# EAGLE design modem_tda (EAGLE 6.5.0)
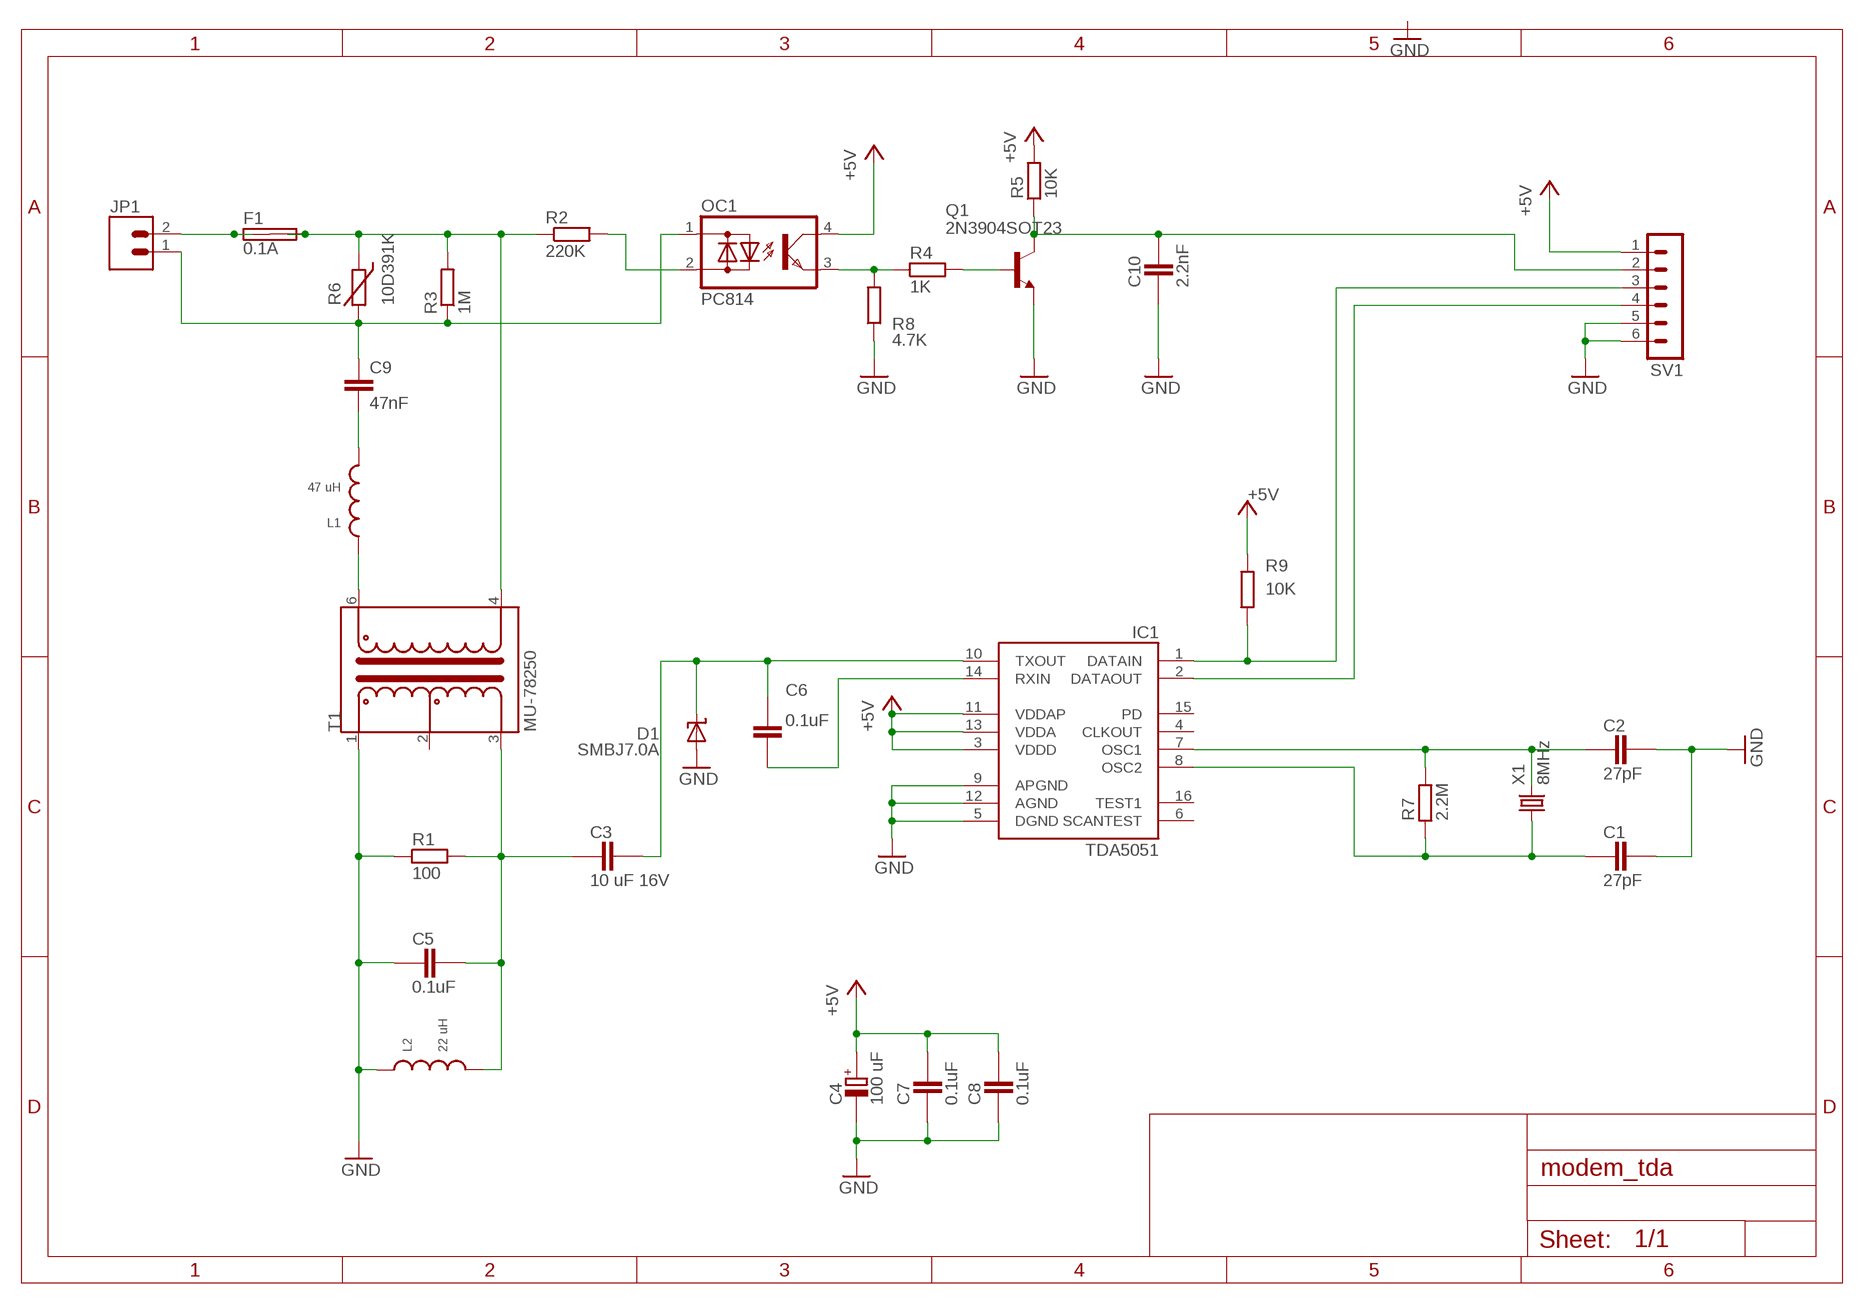
[diagram p0: schematic, sheet 1]

## Parts
C1  27pF  CAPACITOR_0805  [CAPC2012X145AN]
C2  27pF  CAPACITOR_0805  [CAPC2012X145AN]
C3  10 uF 16V  CAPACITOR_1206  [CAPC3215X168N]
C4  100 uF  POLARISED_U_CASE  [CAPMP6032X150N]
C5  0.1uF  CAPACITOR_0805  [CAPC2012X145AN]
C6  0.1uF  CAPACITOR_0805  [CAPC2012X145AN]
C7  0.1uF  CAPACITOR_0805  [CAPC2012X145AN]
C8  0.1uF  CAPACITOR_0805  [CAPC2012X145AN]
C9  47nF  CXXC10B6  [XC10B6]
C10  2.2nF  CAPACITOR_0805  [CAPC2012X145AN]
D1  SMBJ7.0A  SUPPRESSOR-SMBJ  [SMBJ]
F1  0.1A  SHK20L  [SHK20L]
IC1  TDA5051  [SO16W]
JP1  BLUE_TERM  [BLUE_TERM]
L1  47 uH  L-US  [CD43]
L2  22 uH  L-US  [CD43]
OC1  PC814  [DIL04]
Q1  2N3904SOT23  [SOT23-BEC]
R1  100  RESISTOR_0805  [RESC2012X70N]
R2  220K  R-EU_0309/12  [0309/12]
R3  1M  R-EU_0207/10  [0207/10]
R4  1K  RESISTOR_0805  [RESC2012X70N]
R5  10K  RESISTOR_0805  [RESC2012X70N]
R6  10D391K  VARISTOR  [MOV-10D]
R7  2.2M  RESISTOR_0805  [RESC2012X70N]
R8  4.7K  RESISTOR_0805  [RESC2012X70N]
R9  10K  RESISTOR_0805  [RESC2012X70N]
SV1  MA06-1  [MA06-1]
T1  MU-78250  [6-PIN-DIL]
X1  8MHz  CRYSTALHC49S  [HC49/S]

## Nets
+5V: C4.+ C7.2 C8.2 IC1.3(VDDD) IC1.11(VDDAP) IC1.13(VDDA) OC1.4(C) R5.2 R9.2 SV1.1
GND: C1.2 C2.2 C4.- C5.1 C7.1 C8.1 C10.1 D1.A IC1.5(DGND) IC1.9(APGND) IC1.12(AGND) L2.1 Q1.E R1.1 R8.1 SV1.5 SV1.6 T1.1
N$1: F1.1A F1.1B JP1.2
N$2: F1.2A F1.2B R2.1 R3.2 R6.2 T1.4
N$3: C9.1 JP1.1 OC1.1(AC1) R3.1 R6.1
N$4: OC1.2(AC2) R2.2
N$5: C9.2 L1.2
N$6: L1.1 T1.6
N$7: OC1.3(E) R4.1 R8.2
N$8: C3.1 C5.2 L2.2 R1.2 T1.3
N$9: C3.2 C6.2 D1.C IC1.10(TXOUT)
N$10: C10.2 Q1.C R5.1 SV1.2
N$11: C6.1 IC1.14(RXIN)
N$12: C2.1 IC1.7(OSC1) R7.2 X1.2
N$13: C1.1 IC1.8(OSC2) R7.1 X1.1
N$14: IC1.1(DATAIN) R9.1 SV1.3
N$15: IC1.2(DATAOUT) SV1.4
N$16: Q1.B R4.2
Unconnected: IC1.4(CLKOUT) IC1.6(SCANTEST) IC1.15(PD) IC1.16(TEST1) T1.2

## Library data of the parts
C1-C3 C5-C8 C10 = ipc-7351-capacitor:CAPACITOR_
C4 = ipc-7351-capacitor:POLARISED_
C9 = rcl:CX: X CAPACITOR for power line
D1 = diode:SUPPRESSOR-: Suppressor diode
F1 = fuse:SHK20L: FUSE HOLDER 5 x 20 mm, SH contact, SHH1 Schukat, E1073 Buerklin
IC1 = nxp:TDA5051
JP1 = jlab:BLUE_TERM
L1 L2 = jlab_varistors:L-US
OC1 = optocoupler:PC814: SHARP OPTO COUPLER; OC_FARNELL: 9707662; OC_NEWARK: unknown
Q1 = transistor-npn:2N3904: NPN Transistor
R1 R4 R5 R7-R9 = ipc-7351-resistor:RESISTOR_
R2 R3 = rcl:R-EU_: RESISTOR, European symbol
R6 = jlab_varistors:VARISTOR
SV1 = con-lstb:MA06-1: PIN HEADER; OC_FARNELL: unknown; OC_NEWARK: unknown
T1 = jlab:MU-78250
X1 = crystal:CRYSTAL: CRYSTAL; OC_FARNELL: 1667008; OC_NEWARK: unknown

## Board
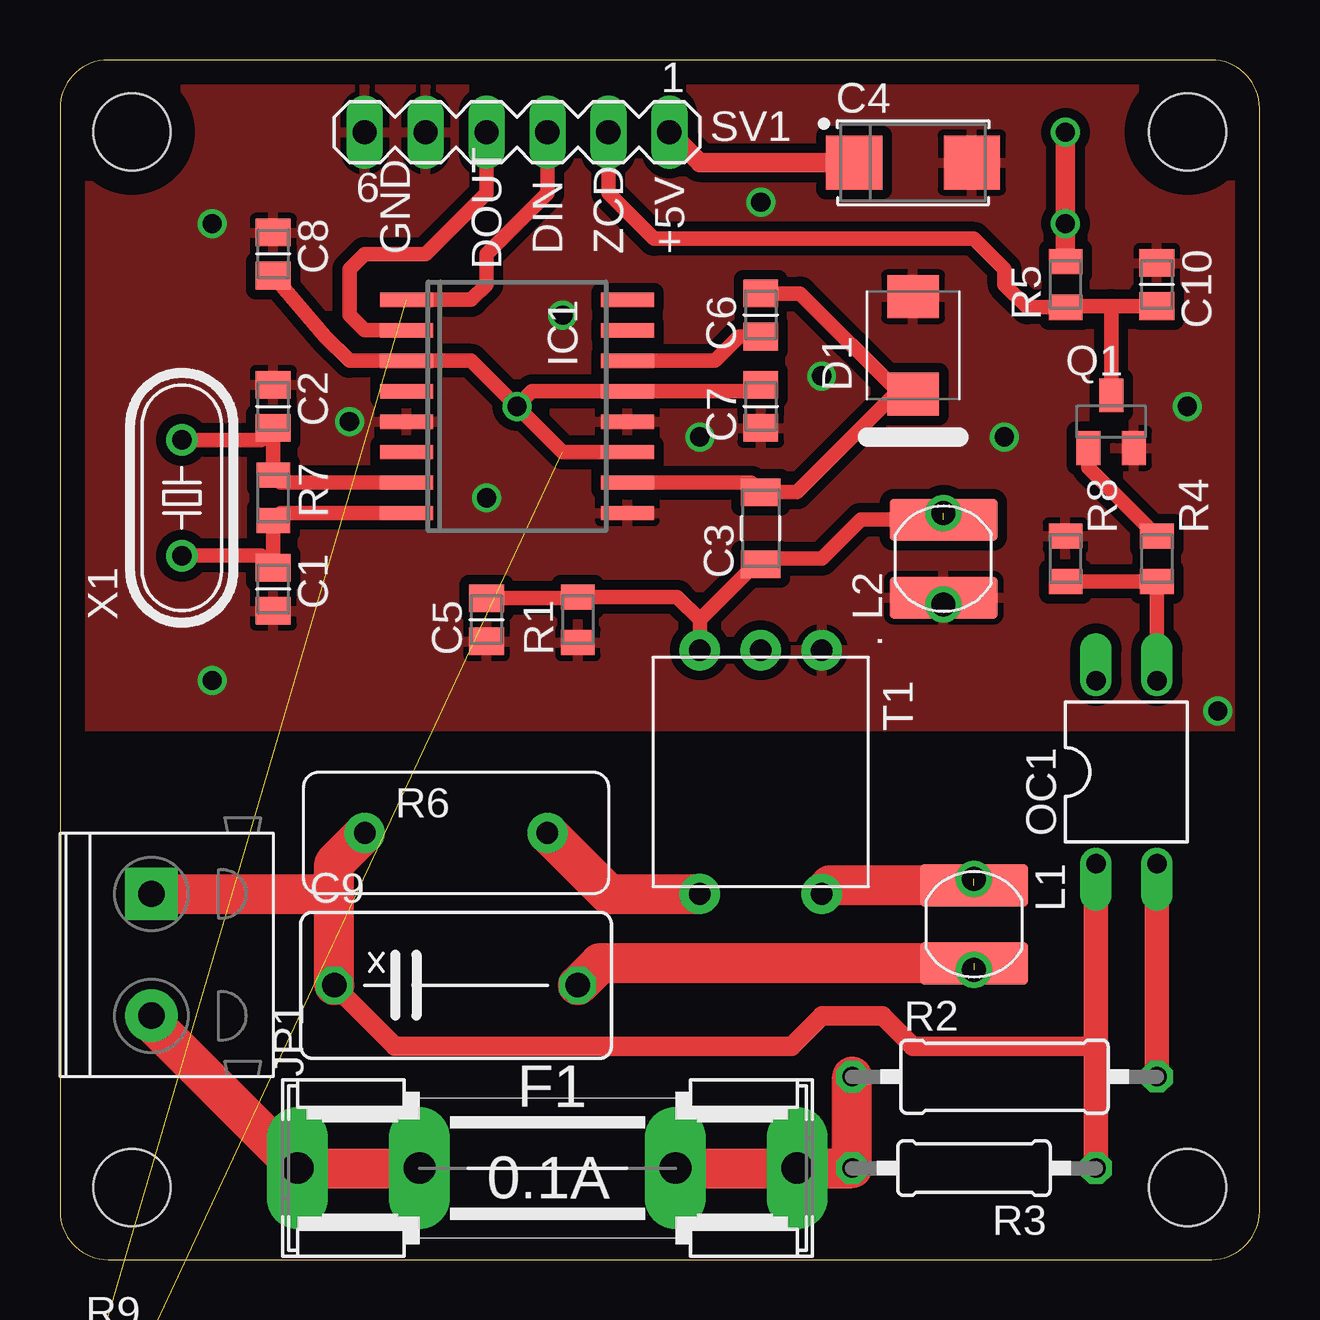
[diagram p1: board, top side]
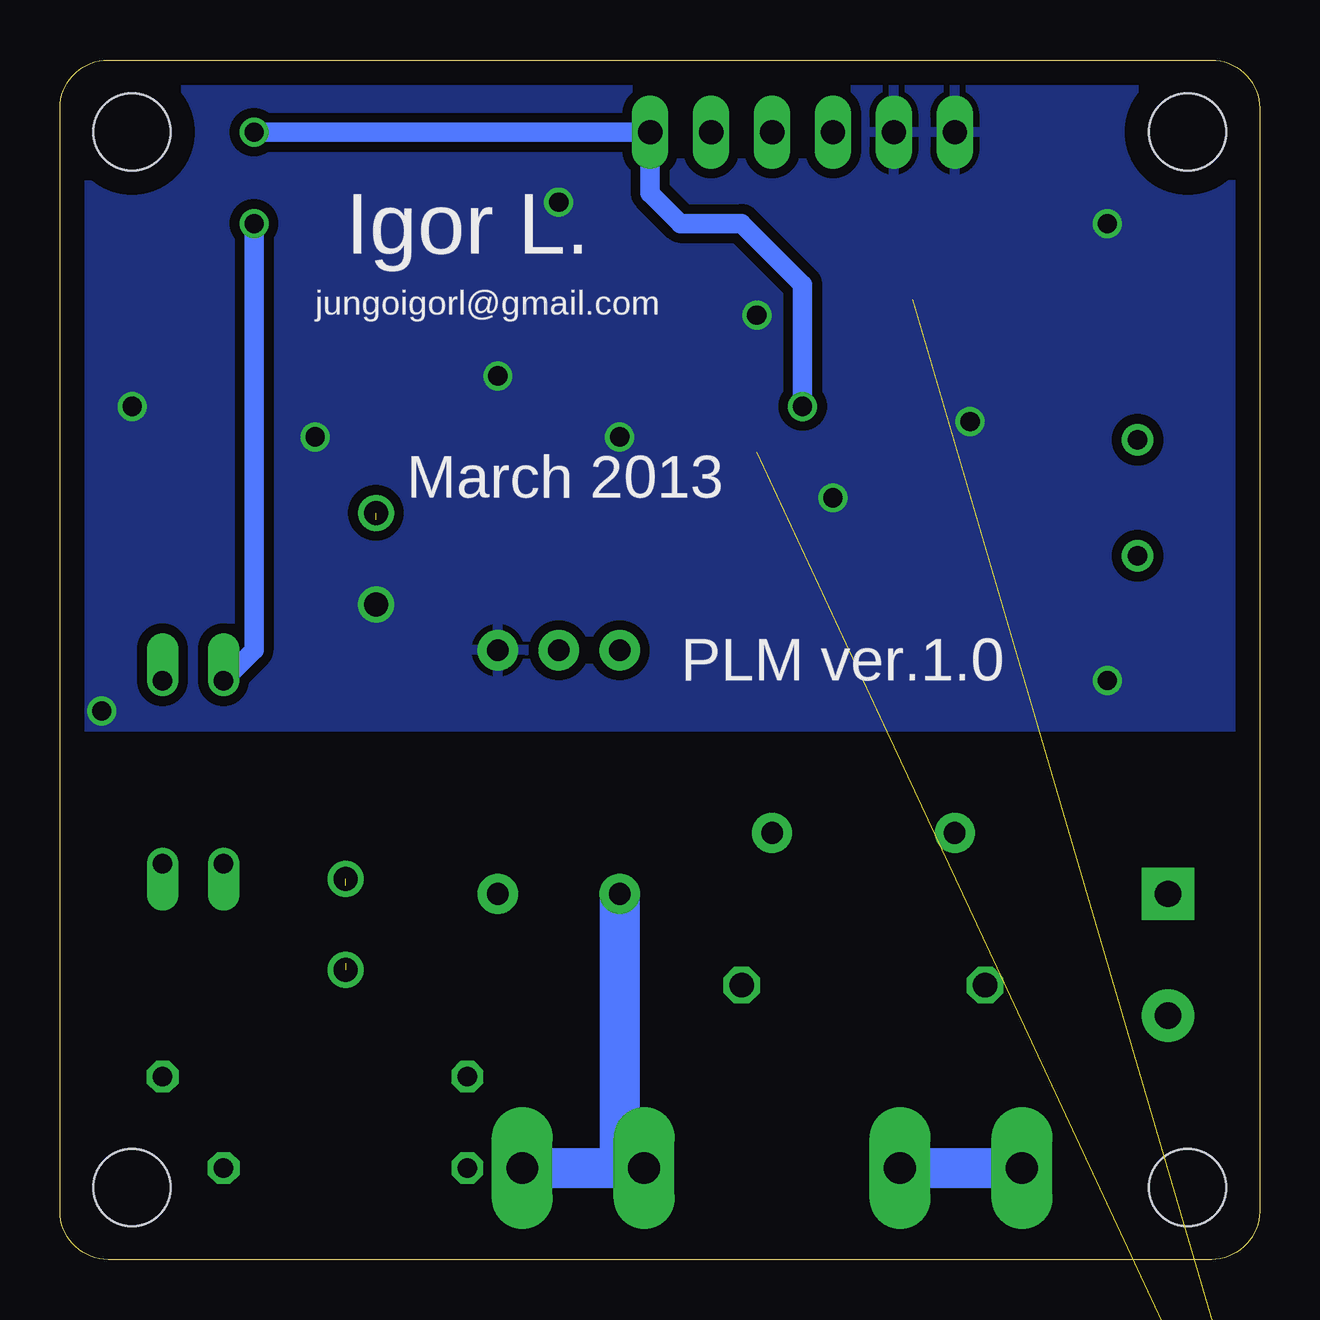
[diagram p2: board, bottom side, seen from below]

Size 50 x 50 mm. Coordinates in mm from the lower left corner, seen from the top.
Outline: 0,48 0,2 arc90 2,0 48,0 arc90 50,2 50,48 arc90 48,50 2,50 arc90 0,48
Copper layers (1*16): Top 0.035mm / dielectric 1.5mm / Bottom 0.035mm
Design rules "plm *": minimum track width 10mil, minimum drill 24mil, track to track 16mil, track to pad 16mil, pad to pad 16mil, via to via 16mil, smd to smd 8mil, copper to edge 40mil, drill to drill 8mil, minimum pad ring 10mil, minimum via ring 8mil, stop-mask expansion 4mil, vias tented up to drill 32mil, thermal gap 10mil
Holes 3.2 mm at 3,3 47,3 47,47 3,47

### Footprints (pad centres in the part's own frame; a part is rotated, then mirrored left to right if it is on the bottom)
CAPC2012X145AN = smd 1.15 x 1.45: 1 -0.9,0; 2 0.9,0
CAPC3215X168N = smd 1.15 x 1.65: 1 -1.5,0; 2 1.5,0
CAPMP6032X150N = smd 2.35 x 2.25: + -2.45,0; - 2.45,0
XC10B6 = drill 1.016 octagon: 1 -5.08,0; 2 5.08,0
SMBJ = smd 1.78 x 2.16: A 2.04,0; C -2.03,0
SHK20L = drill 1.321 pad 2.54 long: 1A -10.414,0; 1B -5.334,0; 2A 10.414,0; 2B 5.334,0
SO16W = smd 0.6 x 2.2: 1 -4.445,-4.6; 2 -3.175,-4.6; 3 -1.905,-4.6; 4 -0.635,-4.6; 5 0.635,-4.6; 6 1.905,-4.6; 7 3.175,-4.6; 8 4.445,-4.6; 9 4.445,4.6; 10 3.175,4.6; 11 1.905,4.6; 12 0.635,4.6; 13 -0.635,4.6; 14 -1.905,4.6; 15 -3.175,4.6; 16 -4.445,4.6
BLUE_TERM = drill 1.1 pad 2.184 square: 1 0,2.54 | drill 1.1 pad 2.184: 2 0,-2.54
CD43 = smd 1.75 x 4.5: 1 -1.625,0; 2 1.625,0
DIL04 = drill 0.813 offset: 1 -1.27,-3.81; 2 1.27,-3.81; 3 1.27,3.81; 4 -1.27,3.81
SOT23-BEC = smd 1 x 1.4: B -0.95,-1.1; C 0,1.1; E 0.95,-1.1
RESC2012X70N = smd 1.05 x 1.4: 1 -0.95,0; 2 0.95,0
0309/12 = drill 0.813 octagon: 1 -6.35,0; 2 6.35,0
0207/10 = drill 0.813 octagon: 1 -5.08,0; 2 5.08,0
MOV-10D = drill 0.9 pad 1.676: 1 -3.81,0; 2 3.81,0
MA06-1 = drill 1.016 long: 1 -6.35,0; 2 -3.81,0; 3 -1.27,0; 4 1.27,0; 5 3.81,0; 6 6.35,0
6-PIN-DIL = drill 0.9 pad 1.676: 1 -5.08,2.54; 2 -5.08,0; 3 -5.08,-2.54; 4 5.08,-2.54; 6 5.08,2.54
HC49/S = drill 0.813: 1 -2.413,0; 2 2.413,0

### Placement (x,y rotation side)
C1  8.89,27.94 270 top
C2  8.89,35.56 90 top
C3  29.21,30.48 90 top
C4  35.56,45.72 0 top
C5  17.78,26.67 90 top
C6  29.21,39.37 90 top
C7  29.21,35.56 90 top
C8  8.89,41.91 270 top
C9  16.51,11.43 0 top
C10  45.72,40.64 270 top
D1  35.56,38.1 90 top
F1  20.32,3.81 0 top
IC1  19.05,35.56 270 top
JP1  3.81,12.7 0 top
L1  38.1,13.97 270 top
L2  36.83,29.21 90 top
OC1  44.45,20.32 0 top
Q1  43.81,34.92 0 top
R1  21.59,26.67 90 top
R2  39.37,7.62 0 top
R3  38.1,3.81 180 top
R4  45.72,29.21 90 top
R5  41.91,40.64 90 top
R6  16.51,17.78 0 top
R7  8.89,31.75 90 top
R8  41.91,29.21 270 top
R9  2.54,-3.81 0 top  (outside the outline)
SV1  19.05,46.99 180 top
T1  29.21,20.32 270 top
X1  5.08,31.75 90 top

### Tracks (layer width: path | path; a pad name or v marks a point on that pad's centre or on a via)
+5V  (via drill 0.8)  (1 unrouted)
  Top 0.61: v19.05,35.56 19.68,36.2 IC1.13 28.95,36.2 C7.2 | v19.05,35.56 20.95,33.66 IC1.11 | v19.05,35.56 17.14,37.47 IC1.3 12.06,37.47 11.06,38.47 C8.2
  Top 0.813: SV1.1 26.67,45.72 C4.+ | v41.91,46.99 v41.91,43.18 R5.2
  Bottom 0.813: v19.05,35.56 19.05,40.64 21.59,43.18 24.13,43.18 25.4,44.45 SV1.1 v41.91,46.99 | OC1.4 41.91,25.4 v41.91,43.18
GND  (via drill 0.8, 1)
  other vias: 26.67,34.29 31.75,36.83 46.99,35.56 17.78,31.75 20.95,39.37 6.35,43.18 6.35,24.13 48.26,22.86 39.37,34.29 29.21,44.07 12.06,34.92 36.83,27.3
  pour Bottom (isolate 0.305): 50,22.23 0,22.23 0,50 50,50
  pour Top (isolate 0.305): 50,22.23 0,22.23 0,50 50,50
N$1
  Top 1.676: JP1.2 3.81,9.91 F1.1A F1.1B
  Bottom 1.676: F1.1A 15.24,3.81
N$2
  Top 1.676: F1.2B F1.2A R3.2 R2.1 | R6.2 22.86,15.24 T1.4
  Bottom 1.676: T1.4 26.67,3.81 F1.2B 30.48,3.81
N$3
  Top 0.813: C9.1 13.97,8.89 30.48,8.89 31.75,10.16 34.29,10.16 35.56,8.89 43.18,8.89
  Top 1.016: R3.1 43.18,8.89 OC1.1
  Top 1.676: C9.1 11.43,15.24 | 11.43,15.24 11.43,16.51 R6.1 | JP1.1 11.43,15.24
N$4
  Top 1.016: R2.2 OC1.2
N$5  (via drill 1)  (1 unrouted)
  Top 1.676: L1.2 22.5,12.35 C9.2
  other vias: 38.1,12.06
N$6  (via drill 1)  (1 unrouted)
  Top 1.676: L1.1 32.1,15.6 T1.6
  other vias: 38.1,15.88
N$7
  Top 0.61: OC1.3 R4.1 R8.2
N$8  (via drill 1)  (1 unrouted)
  Top 0.61: L2.2 33.38,30.84 31.75,29.21 29.44,29.21 C3.1 28.98,28.98 26.67,26.67 | T1.3 26.67,26.67 | 26.67,26.67 25.72,27.62 R1.2 21.54,27.57 C5.2
  other vias: 36.83,31.11
N$9
  Top 0.61: IC1.10 28.8,32.38 C3.2 30.71,31.98 34.8,36.07 D1.C 35.05,36.07 30.85,40.27 C6.2
N$10
  Top 0.61: 43.81,39.74 41.96,39.74 R5.1 40.32,39.69 39.37,40.64 39.37,41.27 38.1,42.55 24.77,42.55 22.86,44.45 SV1.2 | 43.81,39.74 C10.2 | Q1.C 43.81,39.74
N$11
  Top 0.61: IC1.14 27.3,37.47 28.31,38.47 C6.1
N$12
  Top 0.61: IC1.7 9.21,32.38 R7.2 C2.1 8.39,34.16 X1.2
N$13
  Top 0.61: IC1.8 9.21,31.11 R7.1 C1.1 8.39,29.34 X1.1
N$14  (1 unrouted)
  Top 0.61: IC1.1 17.14,40.01 17.78,40.64 17.78,41.91 20.32,44.45 SV1.3
N$15
  Top 0.61: IC1.2 12.7,38.73 12.06,39.37 12.06,41.27 12.7,41.91 15.24,41.91 17.78,44.45 SV1.4
N$16
  Top 0.61: R4.2 42.87,33.02 Q1.B

### Text on the board
tNames: GND | DIN | ZCD | +5V | DOUT
bNames: Igor L. | jungoigorl@gmail.com | March 2013 | PLM ver.1.0